# Altium project main_Bord.PrjPcb
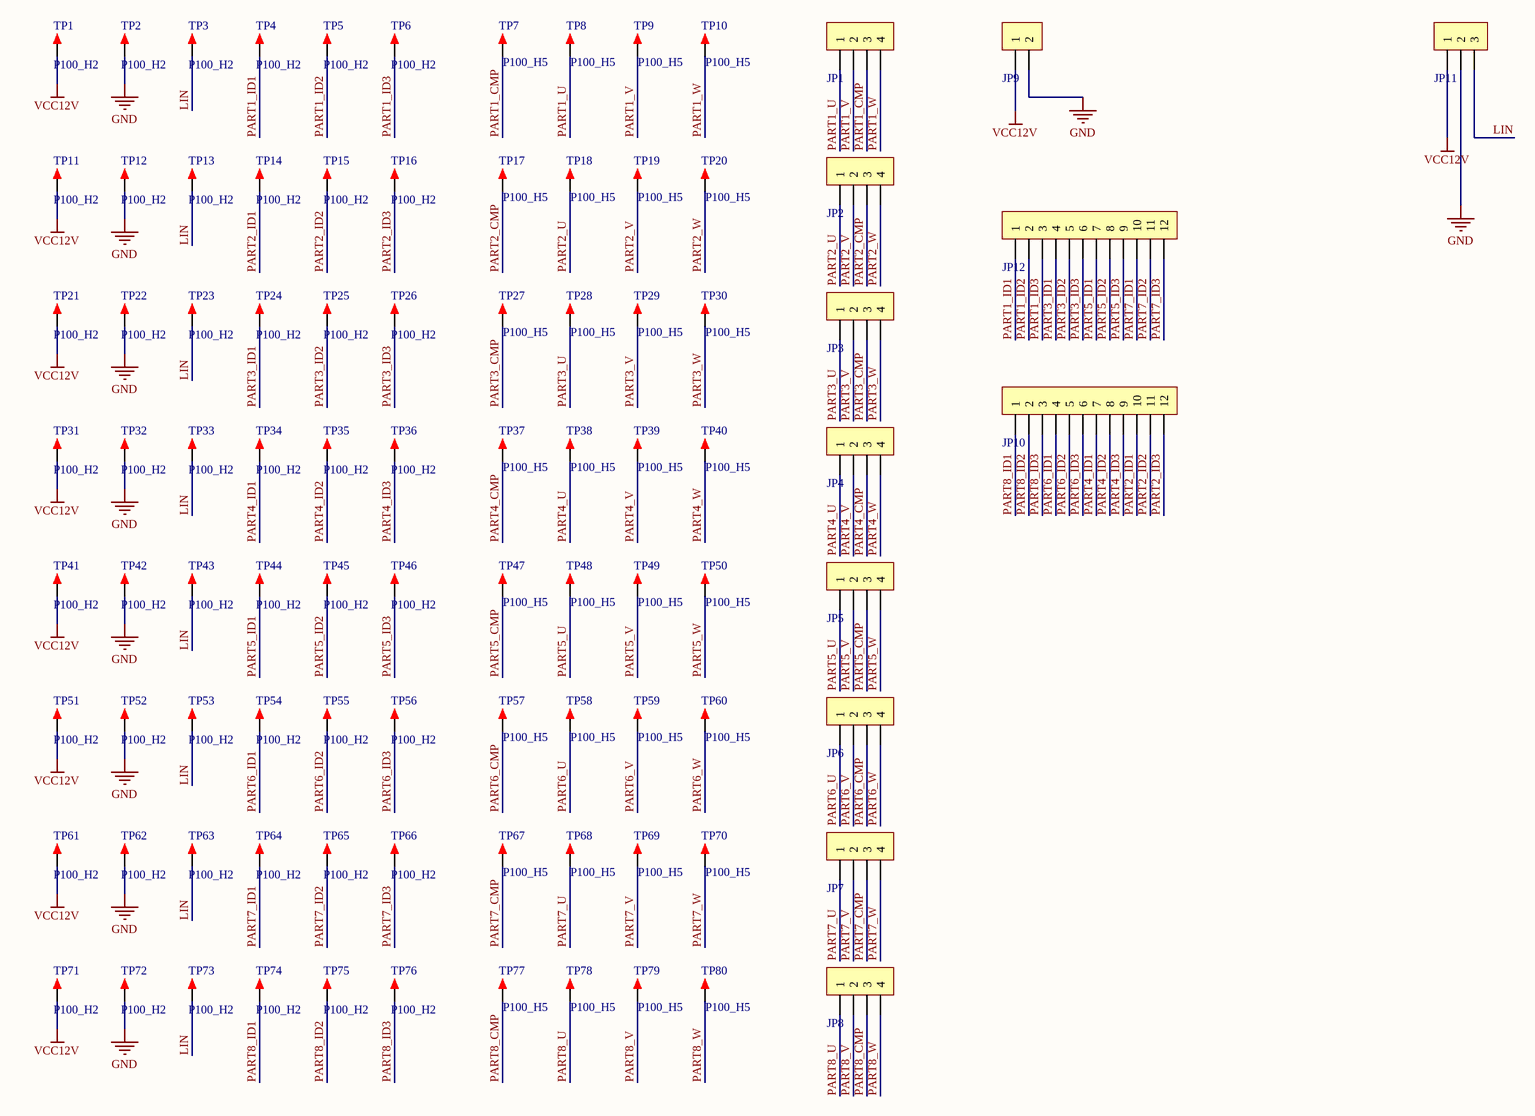
[diagram p0: Sheet1.SchDoc]
1 sheet, 92 parts. Net scope: global (net labels, ports and power ports of the same name join across sheets).
Board file: main_Bord.PcbDoc

## Sheet Sheet1.SchDoc
size A3; SheetNumber: 1; SheetTotal: 1

### Parts
JP1  HDR-1X4  [XH2.54-LS-4P]  (value not drawn)
JP2  HDR-1X4  [XH2.54-LS-4P]  (value not drawn)
JP3  HDR-1X4  [XH2.54-LS-4P]  (value not drawn)
JP4  HDR-1X4  [XH2.54-LS-4P]  (value not drawn)
JP5  HDR-1X4  [XH2.54-LS-4P]  (value not drawn)
JP6  HDR-1X4  [XH2.54-LS-4P]  (value not drawn)
JP7  HDR-1X4  [XH2.54-LS-4P]  (value not drawn)
JP8  HDR-1X4  [XH2.54-LS-4P]  (value not drawn)
JP9  HDR-1X2  [DC-005P]  (value not drawn)
JP10  HDR-1X12  [MX 1.25-WS-12P]  (value not drawn)
JP11  HDR-1X3  [XH2.54-WS-3P]  (value not drawn)
JP12  HDR-1X12  [MX 1.25-WS-12P]  (value not drawn)
TP1  P100_H2  [P100_H2]
TP2  P100_H2  [P100_H2]
TP3  P100_H2  [P100_H2]
TP4  P100_H2  [P100_H2]
TP5  P100_H2  [P100_H2]
TP6  P100_H2  [P100_H2]
TP7  P100_H5  [P100_H5]
TP8  P100_H5  [P100_H5]
TP9  P100_H5  [P100_H5]
TP10  P100_H5  [P100_H5]
TP11  P100_H2  [P100_H2]
TP12  P100_H2  [P100_H2]
TP13  P100_H2  [P100_H2]
TP14  P100_H2  [P100_H2]
TP15  P100_H2  [P100_H2]
TP16  P100_H2  [P100_H2]
TP17  P100_H5  [P100_H5]
TP18  P100_H5  [P100_H5]
TP19  P100_H5  [P100_H5]
TP20  P100_H5  [P100_H5]
TP21  P100_H2  [P100_H2]
TP22  P100_H2  [P100_H2]
TP23  P100_H2  [P100_H2]
TP24  P100_H2  [P100_H2]
TP25  P100_H2  [P100_H2]
TP26  P100_H2  [P100_H2]
TP27  P100_H5  [P100_H5]
TP28  P100_H5  [P100_H5]
TP29  P100_H5  [P100_H5]
TP30  P100_H5  [P100_H5]
TP31  P100_H2  [P100_H2]
TP32  P100_H2  [P100_H2]
TP33  P100_H2  [P100_H2]
TP34  P100_H2  [P100_H2]
TP35  P100_H2  [P100_H2]
TP36  P100_H2  [P100_H2]
TP37  P100_H5  [P100_H5]
TP38  P100_H5  [P100_H5]
TP39  P100_H5  [P100_H5]
TP40  P100_H5  [P100_H5]
TP41  P100_H2  [P100_H2]
TP42  P100_H2  [P100_H2]
TP43  P100_H2  [P100_H2]
TP44  P100_H2  [P100_H2]
TP45  P100_H2  [P100_H2]
TP46  P100_H2  [P100_H2]
TP47  P100_H5  [P100_H5]
TP48  P100_H5  [P100_H5]
TP49  P100_H5  [P100_H5]
TP50  P100_H5  [P100_H5]
TP51  P100_H2  [P100_H2]
TP52  P100_H2  [P100_H2]
TP53  P100_H2  [P100_H2]
TP54  P100_H2  [P100_H2]
TP55  P100_H2  [P100_H2]
TP56  P100_H2  [P100_H2]
TP57  P100_H5  [P100_H5]
TP58  P100_H5  [P100_H5]
TP59  P100_H5  [P100_H5]
TP60  P100_H5  [P100_H5]
TP61  P100_H2  [P100_H2]
TP62  P100_H2  [P100_H2]
TP63  P100_H2  [P100_H2]
TP64  P100_H2  [P100_H2]
TP65  P100_H2  [P100_H2]
TP66  P100_H2  [P100_H2]
TP67  P100_H5  [P100_H5]
TP68  P100_H5  [P100_H5]
TP69  P100_H5  [P100_H5]
TP70  P100_H5  [P100_H5]
TP71  P100_H2  [P100_H2]
TP72  P100_H2  [P100_H2]
TP73  P100_H2  [P100_H2]
TP74  P100_H2  [P100_H2]
TP75  P100_H2  [P100_H2]
TP76  P100_H2  [P100_H2]
TP77  P100_H5  [P100_H5]
TP78  P100_H5  [P100_H5]
TP79  P100_H5  [P100_H5]
TP80  P100_H5  [P100_H5]

### Nets
GND: JP9.2 JP11.2 TP2.1 TP12.1 TP22.1 TP32.1 TP42.1 TP52.1 TP62.1 TP72.1
VCC12V: JP9.1 JP11.1 TP1.1 TP11.1 TP21.1 TP31.1 TP41.1 TP51.1 TP61.1 TP71.1
LIN: JP11.3 TP3.1 TP13.1 TP23.1 TP33.1 TP43.1 TP53.1 TP63.1 TP73.1
PART1_CMP: JP1.3 TP7.1
PART1_ID1: JP12.1 TP4.1
PART1_ID2: JP12.2 TP5.1
PART1_ID3: JP12.3 TP6.1
PART1_U: JP1.1 TP8.1
PART1_V: JP1.2 TP9.1
PART1_W: JP1.4 TP10.1
PART2_CMP: JP2.3 TP17.1
PART2_ID1: JP10.10 TP14.1
PART2_ID2: JP10.11 TP15.1
PART2_ID3: JP10.12 TP16.1
PART2_U: JP2.1 TP18.1
PART2_V: JP2.2 TP19.1
PART2_W: JP2.4 TP20.1
PART3_CMP: JP3.3 TP27.1
PART3_ID1: JP12.4 TP24.1
PART3_ID2: JP12.5 TP25.1
PART3_ID3: JP12.6 TP26.1
PART3_U: JP3.1 TP28.1
PART3_V: JP3.2 TP29.1
PART3_W: JP3.4 TP30.1
PART4_CMP: JP4.3 TP37.1
PART4_ID1: JP10.7 TP34.1
PART4_ID2: JP10.8 TP35.1
PART4_ID3: JP10.9 TP36.1
PART4_U: JP4.1 TP38.1
PART4_V: JP4.2 TP39.1
PART4_W: JP4.4 TP40.1
PART5_CMP: JP5.3 TP47.1
PART5_ID1: JP12.7 TP44.1
PART5_ID2: JP12.8 TP45.1
PART5_ID3: JP12.9 TP46.1
PART5_U: JP5.1 TP48.1
PART5_V: JP5.2 TP49.1
PART5_W: JP5.4 TP50.1
PART6_CMP: JP6.3 TP57.1
PART6_ID1: JP10.4 TP54.1
PART6_ID2: JP10.5 TP55.1
PART6_ID3: JP10.6 TP56.1
PART6_U: JP6.1 TP58.1
PART6_V: JP6.2 TP59.1
PART6_W: JP6.4 TP60.1
PART7_CMP: JP7.3 TP67.1
PART7_ID1: JP12.10 TP64.1
PART7_ID2: JP12.11 TP65.1
PART7_ID3: JP12.12 TP66.1
PART7_U: JP7.1 TP68.1
PART7_V: JP7.2 TP69.1
PART7_W: JP7.4 TP70.1
PART8_CMP: JP8.3 TP77.1
PART8_ID1: JP10.1 TP74.1
PART8_ID2: JP10.2 TP75.1
PART8_ID3: JP10.3 TP76.1
PART8_U: JP8.1 TP78.1
PART8_V: JP8.2 TP79.1
PART8_W: JP8.4 TP80.1

### Library data of the parts
JP1-JP8 = Header 4: 4P接插件; 版权归属: 源创客; BOM名称: 4P接插件; 学习资源: www.ooocke.com
JP9 = Header 2: 2P接插件; 版权归属: 源创客; BOM名称: 2P接插件; 学习资源: www.ooocke.com
JP10 JP12 = Header 12: 12P接插件; 版权归属: 源创客; BOM名称: 12P接插件; 学习资源: www.ooocke.com
JP11 = Header 3: 3P接插件; 版权归属: 源创客; BOM名称: 3P接插件; 学习资源: www.ooocke.com
TP1-TP80 = TEST: 测试点; 版权归属: 源创客; BOM名称: 测试点; 学习资源: www.ooocke.com